# EAGLE design CET_4_27_22 (EAGLE 9.6.2)
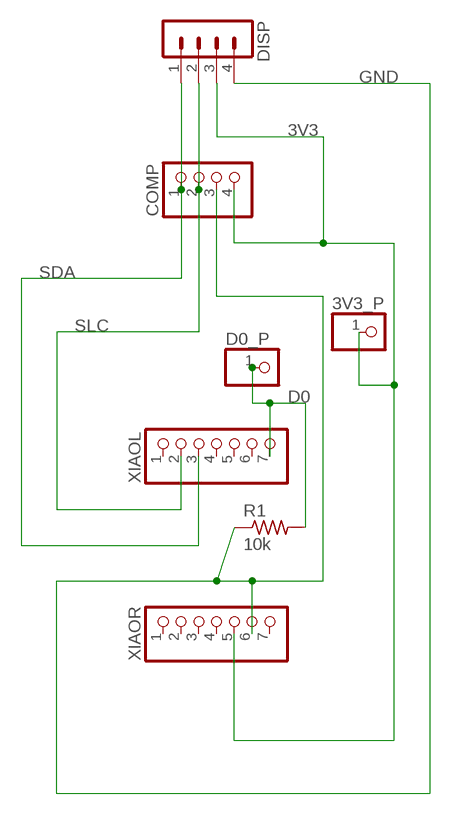
[diagram p0: schematic, sheet 1]

## Parts
3V3_P  PINHD-1X1  [1X01]
COMP  PINHD-1X4/90  [1X04/90]
D0_P  PINHD-1X1  [1X01]
DISP  MA04-1  [MA04-1]
R1  10k  R-US_0204/7  [0204/7]
XIAOL  PINHD-1X7  [1X07]
XIAOR  PINHD-1X7  [1X07]

## Nets
3V3: 3V3_P.1 COMP.4 DISP.3 XIAOR.5
D0: D0_P.1 R1.2 XIAOL.7
GND: COMP.3 DISP.4 R1.1 XIAOR.6
SDA: COMP.1 DISP.1 XIAOL.3
SLC: COMP.2 DISP.2 XIAOL.2
Unconnected: XIAOL.1 XIAOL.4 XIAOL.5 XIAOL.6 XIAOR.1 XIAOR.2 XIAOR.3 XIAOR.4 XIAOR.7

## Library data of the parts
3V3_P D0_P = pinhead:PINHD-1X1: PIN HEADER
COMP = pinhead:PINHD-1X4: PIN HEADER
DISP = con-lstb:MA04-1: PIN HEADER; OC_FARNELL: unknown; OC_NEWARK: unknown
R1 = rcl:R-US_: RESISTOR, American symbol; SPICEPREFIX: R
XIAOL XIAOR = pinhead:PINHD-1X7: PIN HEADER

## Board
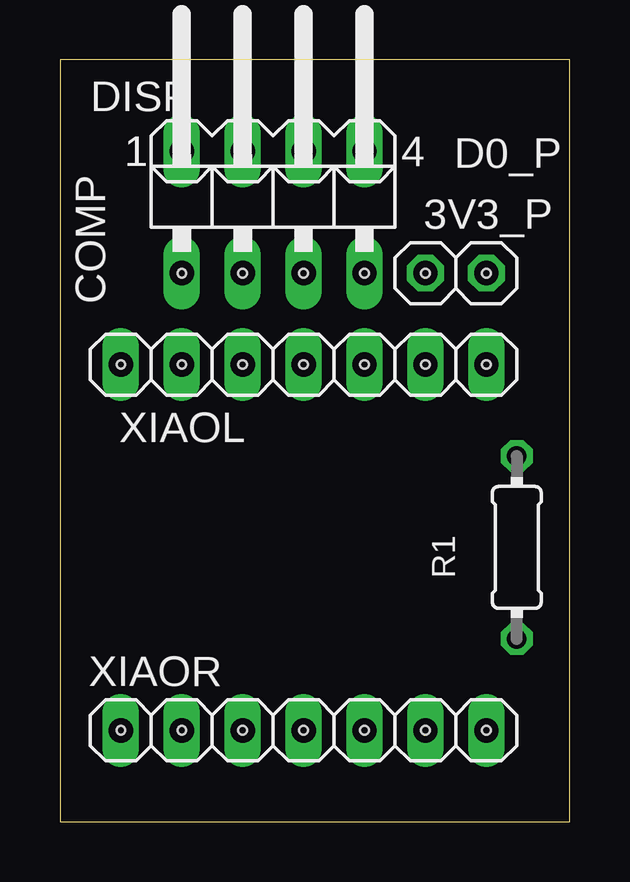
[diagram p1: board, top side]
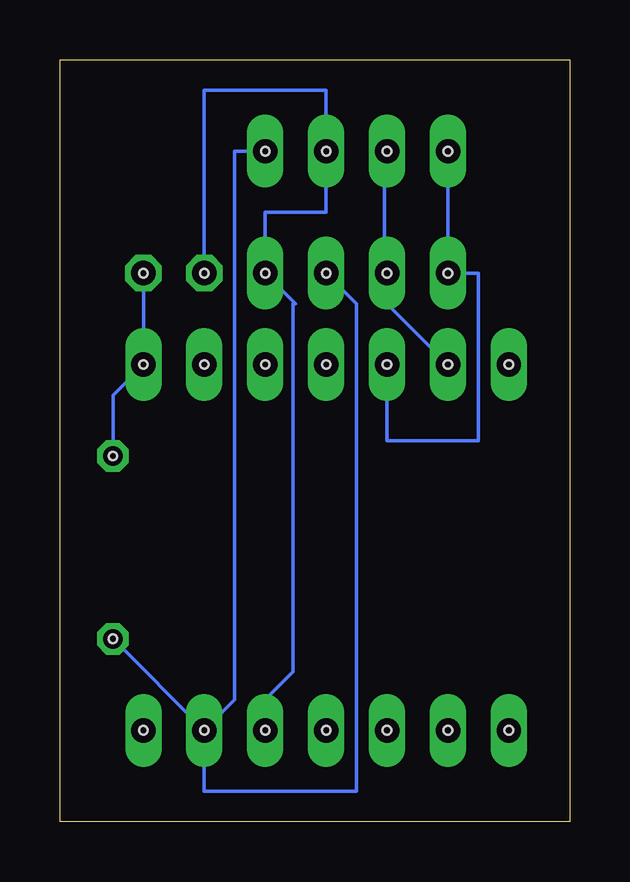
[diagram p2: board, bottom side, seen from below]

Size 21.26 x 31.74 mm. Coordinates in mm from the lower left corner, seen from the top.
Outline: 0,0 21.26,0 21.26,31.74 0,31.74 0,0
Copper layers (1*16): Top 0.035mm / dielectric 1.5mm / Bottom 0.035mm
Design rules "default": minimum track width 6mil, minimum drill 0.35mm, track to track 6mil, track to pad 6mil, pad to pad 6mil, via to via 6mil, smd to smd 6mil, copper to edge 40mil, drill to drill 6mil, minimum pad ring 10mil, minimum via ring 8mil, stop-mask expansion 4mil, vias tented up to drill 0mil, thermal gap 10mil
Holes 0.35 mm at 17.78,22.86 19.05,15.24 19.05,7.62 12.7,22.86 10.16,22.86 7.62,22.86 5.08,22.86 5.08,27.94 7.62,27.94 10.16,27.94 12.7,27.94 2.54,19.05 5.08,19.05 7.62,19.05 10.16,19.05 12.7,19.05 15.24,19.05 17.78,19.05 2.54,3.81 5.08,3.81 7.62,3.81 10.16,3.81 12.7,3.81 15.24,3.81 17.78,3.81 15.24,22.86

### Footprints (pad centres in the part's own frame; a part is rotated, then mirrored left to right if it is on the bottom)
1X01 = drill 1.016 octagon: 1 0,0
1X04/90 = drill 1.016 long: 1 -3.81,-3.81; 2 -1.27,-3.81; 3 1.27,-3.81; 4 3.81,-3.81
MA04-1 = drill 1.016 long: 1 -3.81,0; 2 -1.27,0; 3 1.27,0; 4 3.81,0
0204/7 = drill 0.813 octagon: 1 -3.81,0; 2 3.81,0
1X07 = drill 1.016 long: 1 -7.62,0; 2 -5.08,0; 3 -2.54,0; 4 0,0; 5 2.54,0; 6 5.08,0; 7 7.62,0

### Placement (x,y rotation side)
3V3_P  15.24,22.86 0 top
COMP  8.89,26.67 0 top
D0_P  17.78,22.86 0 top
DISP  8.89,27.94 0 top
R1  19.05,11.43 90 top
XIAOL  10.16,19.05 0 top
XIAOR  10.16,3.81 0 top

### Tracks (layer width: path | path; a pad name or v marks a point on that pad's centre or on a via)
3V3
  Bottom 0.152: XIAOR.5 12.7,5.08 11.53,6.25 11.53,21.59 11.43,21.59 COMP.4 | 3V3_P.1 15.24,30.48 10.16,30.48 DISP.3 10.16,25.4 12.7,25.4 COMP.4
D0
  Bottom 0.152: R1.2 19.05,17.78 XIAOL.7 D0_P.1
GND
  Bottom 0.152: DISP.4 13.97,27.94 13.97,5.08 XIAOR.6 | COMP.3 8.89,21.59 8.89,1.27 15.24,1.27 XIAOR.6 | R1.1 XIAOR.6
SDA
  Bottom 0.152: DISP.1 COMP.1 3.81,22.86 3.81,15.88 7.62,15.88 XIAOL.3
SLC
  Bottom 0.152: XIAOL.2 7.72,21.69 7.72,22.86 | 7.72,22.86 7.72,27.89 DISP.2 | 7.72,22.86 COMP.2